# Altium schematic sheet piccaloSchematic.SchDoc
size A
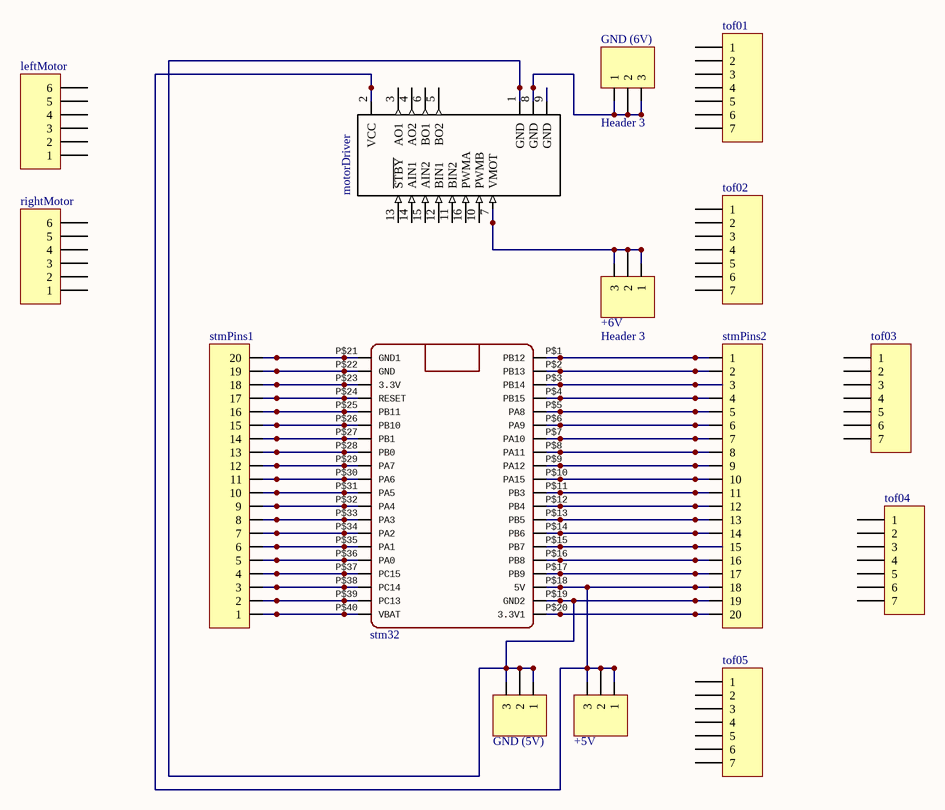
[diagram p0: piccaloSchematic.SchDoc]

## Parts
+5V  Header 3  [HDR1X3]  (value not drawn)
+6V  Header 3  [HDR1X3]
GND_(5V)  Header 3  [HDR1X3]  (value not drawn)
GND_(6V)  Header 3  [HDR1X3]
leftMotor  Header 6  [HDR1X6]  (value not drawn)
motorDriver  POLOLU-713  [*SHIELD_POLOLU-713]  (value not drawn)
rightMotor  Header 6  [HDR1X6]  (value not drawn)
stm32  BLUE_PILLADVANCED  [BLUE_PILL_ADV]  (value not drawn)
stmPins1  Header 20  [HDR1X20]  (value not drawn)
stmPins2  Header 20  [HDR1X20]  (value not drawn)
tof01  Header 7  [HDR1X7]  (value not drawn)
tof02  Header 7  [HDR1X7]  (value not drawn)
tof03  Header 7  [HDR1X7]  (value not drawn)
tof04  Header 7  [HDR1X7]  (value not drawn)
tof05  Header 7  [HDR1X7]  (value not drawn)

## Nets
Net+5V_1: +5V.1 +5V.2 +5V.3 motorDriver.2(VCC) stm32.P$18(5V) stmPins2.18
Net+6V_1: +6V.1 +6V.2 +6V.3 motorDriver.7(VMOT)
NetGND_(5V)_1: GND_(5V).1 GND_(5V).2 GND_(5V).3 motorDriver.1(GND) stm32.P$19(GND2) stmPins2.19
NetGND_(6V)_1: GND_(6V).1 GND_(6V).2 GND_(6V).3 motorDriver.8(GND)
Netstm32_P$1: stm32.P$1(PB12) stmPins2.1
Netstm32_P$2: stm32.P$2(PB13) stmPins2.2
Netstm32_P$3: stm32.P$3(PB14) stmPins2.3
Netstm32_P$4: stm32.P$4(PB15) stmPins2.4
Netstm32_P$5: stm32.P$5(PA8) stmPins2.5
Netstm32_P$6: stm32.P$6(PA9) stmPins2.6
Netstm32_P$7: stm32.P$7(PA10) stmPins2.7
Netstm32_P$8: stm32.P$8(PA11) stmPins2.8
Netstm32_P$9: stm32.P$9(PA12) stmPins2.9
Netstm32_P$10: stm32.P$10(PA15) stmPins2.10
Netstm32_P$11: stm32.P$11(PB3) stmPins2.11
Netstm32_P$12: stm32.P$12(PB4) stmPins2.12
Netstm32_P$13: stm32.P$13(PB5) stmPins2.13
Netstm32_P$14: stm32.P$14(PB6) stmPins2.14
Netstm32_P$15: stm32.P$15(PB7) stmPins2.15
Netstm32_P$16: stm32.P$16(PB8) stmPins2.16
Netstm32_P$17: stm32.P$17(PB9) stmPins2.17
Netstm32_P$20: stm32.P$20(3.3V1) stmPins2.20
Netstm32_P$21: stm32.P$21(GND1) stmPins1.20
Netstm32_P$22: stm32.P$22(GND) stmPins1.19
Netstm32_P$23: stm32.P$23(3.3V) stmPins1.18
Netstm32_P$24: stm32.P$24(RESET) stmPins1.17
Netstm32_P$25: stm32.P$25(PB11) stmPins1.16
Netstm32_P$26: stm32.P$26(PB10) stmPins1.15
Netstm32_P$27: stm32.P$27(PB1) stmPins1.14
Netstm32_P$28: stm32.P$28(PB0) stmPins1.13
Netstm32_P$29: stm32.P$29(PA7) stmPins1.12
Netstm32_P$30: stm32.P$30(PA6) stmPins1.11
Netstm32_P$31: stm32.P$31(PA5) stmPins1.10
Netstm32_P$32: stm32.P$32(PA4) stmPins1.9
Netstm32_P$33: stm32.P$33(PA3) stmPins1.8
Netstm32_P$34: stm32.P$34(PA2) stmPins1.7
Netstm32_P$35: stm32.P$35(PA1) stmPins1.6
Netstm32_P$36: stm32.P$36(PA0) stmPins1.5
Netstm32_P$37: stm32.P$37(PC15) stmPins1.4
Netstm32_P$38: stm32.P$38(PC14) stmPins1.3
Netstm32_P$39: stm32.P$39(PC13) stmPins1.2
Netstm32_P$40: stm32.P$40(VBAT) stmPins1.1

Not connected (* = marked no-connect by the designer): leftMotor 1 2 3 4 5 6; motorDriver 3(AO1) 4(AO2) 5(BO2) 6(BO1) 9(GND) 10(PWMB) 11(BIN2) 12(BIN1) 13(~{STBY}) 14(AIN1) 15(AIN2) 16(PWMA); rightMotor 1 2 3 4 5 6; tof01 1 2 3 4 5 6 7; tof02 1 2 3 4 5 6 7; tof03 1 2 3 4 5 6 7; tof04 1 2 3 4 5 6 7; tof05 1 2 3 4 5 6 7

## Library data of the parts
+5V +6V GND_(5V) GND_(6V) = Header 3: Header, 3-Pin; LatestRevisionDate: 17-Jul-2002; LatestRevisionNote: Re-released for DXP Platform.; Publisher: Altium Limited
leftMotor rightMotor = Header 6: Header, 6-Pin; LatestRevisionDate: 17-Jul-2002; LatestRevisionNote: Re-released for DXP Platform.; Publisher: Altium Limited
motorDriver = POLOLU-713: DC-motor driver; IC: TB6612FNG; 100kHz; 1A; Uin mot: 4.5; MF: Pololu; SnapEDA_Link: https://www.snapeda.com/parts/POLOLU-713/Pololu/view-part/?ref=snap; Availability: Unavailable; Price: None; Package: None; MP: POLOLU-713; Value: *
stmPins1 stmPins2 = Header 20: Header, 20-Pin; LatestRevisionDate: 17-Jul-2002; LatestRevisionNote: Re-released for DXP Platform.; Publisher: Altium Limited
tof01 tof02 tof03 tof04 tof05 = Header 7: Header, 7-Pin; LatestRevisionDate: 17-Jul-2002; LatestRevisionNote: Re-released for DXP Platform.; Publisher: Altium Limited